# Altium schematic sheet Triggers.SchDoc: Triggers
size 420 x 297 mm; SheetNumber: 7; SheetTotal: 8
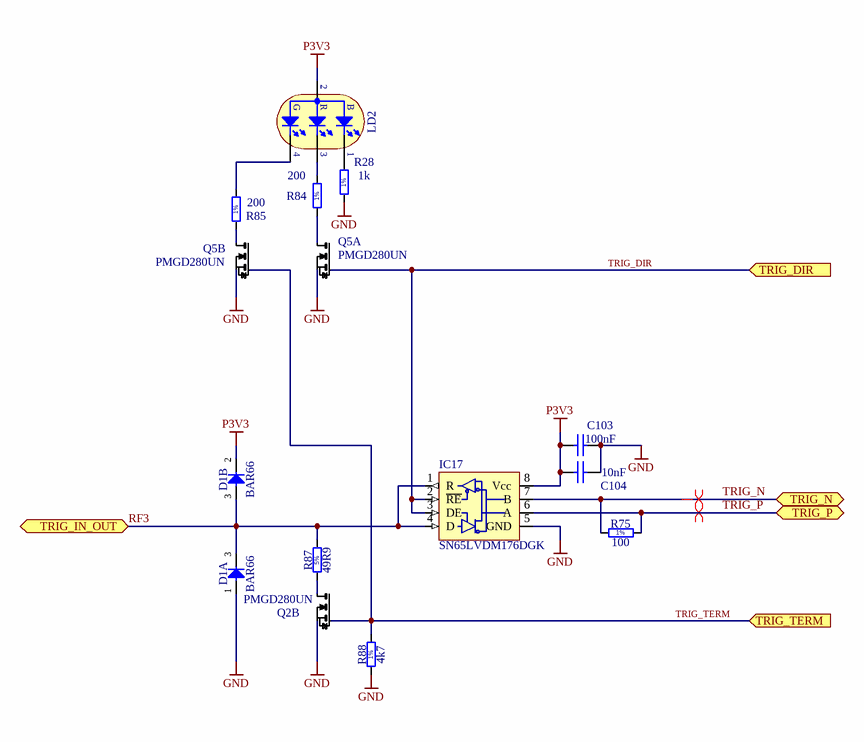
[diagram p0: Triggers.SchDoc]

## Parts
C103  100nF  [CAPC0603X33N]
C104  10nF  [CAPC0603X33N]
D1  BAR66  [SOT95P240X110-3N]  (parts A,B of 2)
IC17  SN65LVDM176DGK  [MSOP8 TI/AD]
LD2  Blue/Red/Green  [LED_AVAGO_HSMF-C113]  (value not drawn)
Q2  PMGD280UN  [SOT-363]  (part B of 2)
Q5  PMGD280UN  [SOT-363]  (parts A,B of 2)
R28  1k  [RESC1005X40N]
R75  100  [RESC1005X40N]
R84  200  [RESC1005X40N]
R85  200  [RESC1005X40N]
R87  49R9  [RESC3225X70N]
R88  4k7  [RESC1005X40N]

## Ports
TRIG_DIR (in), TRIG_IN_OUT (bidir), TRIG_N (bidir), TRIG_P (bidir), TRIG_TERM (in)

## Nets
GND: C103.2 C104.2 D1.1(A) IC17.5(GND) Q2.4(S1) Q5.1(S1) Q5.4(S1) R28.1 R88.1
P3V3: C103.1 C104.1 D1.2(C) IC17.8(Vcc) LD2.2(AC)
RF3: D1.3(COMAC) IC17.1(R) IC17.4(D) R87.2 ; port TRIG_IN_OUT
TRIG_DIR: IC17.2(~{RE}) IC17.3(DE) Q5.2(G1) ; port TRIG_DIR
TRIG_N: IC17.7(B) R75.1 ; port TRIG_N
TRIG_P: IC17.6(A) R75.2 ; port TRIG_P
TRIG_TERM: Q2.5(G1) Q5.5(G1) R88.2 ; port TRIG_TERM
NetLD2_1: LD2.1(CB) R28.2
NetLD2_3: LD2.3(CR) R84.2
NetLD2_4: LD2.4(CG) R85.2
NetQ2_6: Q2.6(D1) R87.1
NetQ5_3: Q5.3(D1) R84.1
NetQ5_6: Q5.6(D1) R85.1

## Layout directives
differential pair: TRIG_N, TRIG_P

## Notes on the sheet
- Project/Equipment
- Document
- FMC_130MSPS_4CH
- Designer
- Drawn by
- Check.by
- Copyright Creotech Instruments SA 2014.
  This documentation describes Open Hardware and is licensed under the CERN OHL v.1.1. You may redistribute and modify this documentation under the terms of the CERN OHL v.1.1. (http://ohwr.org/CERNOHL). This documentation is distributed WITHOUT ANY EXPRESS OR IMPLIED WARRANTY, INCLUDING OF MERCHANTABILITY, SATISFACTORY QUALITY AND FITNESS FOR A PARTICULAR PURPOSE. Please see the CERN OHL v.1.1 for applicable conditions.
- Creotech Instruments S.A.
- File
- Last Mod.
- Print Date
- Sheet
- Size
- A3
- of
- Rev
- (in symbol LED_AVAGO_HSMF-C113) G; R; B
- (in symbol R0402_1K_1%_0.0625W_100PPM) 1%
- (in symbol R0402_4K7_1%_0.0625W_100PPM) 1%
- (in symbol R0402_100R_1%_0.0625W_100PPM) 1%
- (in symbol R0402_200R_1%_0.0625W_100PPM) 1%
- (in symbol R1210_270R_5%_0.5W_200PPM) 5%

## Library data of the parts
C103 = CC0201_100NF_6.3V_10%_X5R: Non-polarised capacitor; Part Description: SMD Multilayer Chip Ceramic Capacitor; Manufacturer: GENERIC; Manufacturer1 Part Number: 02016D104KAT2A; Voltage: 6.3V; TC: X5R; Tolerance: ±10%; Table: Capacitors SMD; Part Number: CC0201_100NF_6.3V_10%_X5R; Component Kind: Standard; Component Type: Standard; Pin Count: 2; Value: 100nF; Status: Not Recommended; Manufacturer Part Number: CC0201_100NF_6.3V_10%_X5R; Case: 0201; Mounted: Yes; Socket: No; SMD: Yes; Manufacturer1 Example: AVX; Manufacturer1 ComponentHeight: 0.33mm; HelpURL: \\cern.ch\dfs\Applications\Altium\Datasheets\CC0201_X5R_AVX.pdf; Author: CERN DEM JLC; CreateDate: 2007-12-03; LatestRevisionDate: 2007-12-03
C104 = CC0201_10NF_10V_10%_X5R: Non-polarised capacitor; Part Description: SMD Multilayer Chip Ceramic Capacitor; Manufacturer: GENERIC; Manufacturer1 Part Number: 0201ZD103KAT2A; Voltage: 10V; TC: X5R; Tolerance: ±10%; Table: Capacitors SMD; Part Number: CC0201_10NF_10V_10%_X5R; Component Kind: Standard; Component Type: Standard; Pin Count: 2; Value: 10nF; Status: Not Recommended; Manufacturer Part Number: CC0201_10NF_10V_10%_X5R; Case: 0201; Mounted: Yes; Socket: No; SMD: Yes; Manufacturer1 Example: AVX; Manufacturer1 ComponentHeight: 0.33mm; HelpURL: \\cern.ch\dfs\Applications\Altium\Datasheets\CC0201_X5R_AVX.pdf; Author: CERN DEM JLC; CreateDate: 2007-12-03; LatestRevisionDate: 2007-12-03
D1 = BAR66: Serial Diode; Part Description: Silicon PIN Diode Array (Series Connected); Manufacturer: INFINEON; Voltage: 150V; Power: 250mA; Table: Diodes; Part Number: BAR66; Component Kind: Standard; Component Type: Standard; Device: BAR66; PackageDescription: SOT23 3-Leads, Pitch 0.95mm - Body 1.3x2.9mm, IPC Medium Density; Manufacturer Part Number: BAR66; Pin Count: 3; Case: SOT23; Mounted: Yes; Socket: No; SMD: Yes; ComponentHeight: 1.1mm; HelpURL: \\cern.ch\dfs\Applications\Altium\Datasheets\BAR66.pdf; Author: CERN DEM JLC; CreateDate: 18/1/2010; LatestRevisionDate: 5/10/2010
IC17 = SN65LVDM176: High Speed Differential Transceiver LVDS/LVTTL; ComponentLink1Description: Datasheet; ComponentLink1URL: C:\TSR\Laurin\Projects\FMC\CERN DAC\Parts\Digital\SN65LVDM176.pdf
LD2 = LED_AVAGO_HSMF-C113: Tricolor LEDs 1 Cathode Blue, 2 Common Anode, 3 Cathode Red, 4 Cathode Green; Part Description: Right Angle Tricolor (Blue, Red, Green) Surface Mount ChipLED; Manufacturer: AVAGO TECHNOLOGIES; Table: LEDs & Displays; Part Number: LED_AVAGO_HSMF-C113; Component Kind: Standard; Component Type: Standard; Color: Blue/Red/Green; PackageDescription: Right Angle Tricolor Surface Mount ChipLED, Body 2.5x1mm; Manufacturer Part Number: HSMF-C113; Pin Count: 4; Mounted: Yes; Socket: No; SMD: Yes; ComponentHeight: 1mm; HelpURL: \\cern.ch\dfs\Applications\Altium\Datasheets\LED_AVAGO_HSMF-C113.pdf; Author: CERN DEM JLC; CreateDate: 2010-09-29; LatestRevisionDate: 2010-09-29
Q2 Q5 = Q_PMGD280UN: Dual NMOS 20V,08.A, 340mR, Vt=0.7V
R28 = R0402_1K_1%_0.0625W_100PPM: Resistor - 1%; Part Description: General Purpose Thick Film Chip Resistor; Manufacturer: GENERIC; Manufacturer1 Part Number: 232270671002; TC: ±100ppm/°C; Table: Resistors SMD; Part Number: R0402_1K_1%_0.0625W_100PPM; Component Kind: Standard; Component Type: Standard; Pin Count: 2; Value: 1k; Status: Not recommended; Power: 0.0625W; Tolerance: ±1%; Manufacturer Part Number: R0402_1K_1%_0.0625W_100PPM; Case: 0402; Mounted: Yes; Socket: No; SMD: Yes; Manufacturer1 Example: PHYCOMP; Manufacturer1 ComponentHeight: 0.4mm; HelpURL: \\cern.ch\dfs\Applications\Altium\Datasheets\R0402_Phycomp_RC0402.pdf; Author: CERN DEM JLC; CreateDate: 2007-12-03; LatestRevisionDate: 2008-03-13
R75 = R0402_100R_1%_0.0625W_100PPM: Resistor - 1%; Part Description: General Purpose Thick Film Chip Resistor; Manufacturer: GENERIC; Manufacturer1 Part Number: 232270671001; TC: ±100ppm/°C; Table: Resistors SMD; Part Number: R0402_100R_1%_0.0625W_100PPM; Component Kind: Standard; Component Type: Standard; Pin Count: 2; Value: 100; Status: Not recommended; Power: 0.0625W; Tolerance: ±1%; Manufacturer Part Number: R0402_100R_1%_0.0625W_100PPM; Case: 0402; Mounted: Yes; Socket: No; SMD: Yes; Manufacturer1 Example: PHYCOMP; Manufacturer1 ComponentHeight: 0.4mm; HelpURL: \\cern.ch\dfs\Applications\Altium\Datasheets\R0402_Phycomp_RC0402.pdf; Author: CERN DEM JLC; CreateDate: 2007-12-03; LatestRevisionDate: 2008-03-13
R84 R85 = R0402_200R_1%_0.0625W_100PPM: Resistor - 1%; Part Description: General Purpose Thick Film Chip Resistor; Manufacturer: GENERIC; Manufacturer1 Part Number: 232270672001; TC: ±100ppm/°C; Table: Resistors SMD; Part Number: R0402_200R_1%_0.0625W_100PPM; Component Kind: Standard; Component Type: Standard; Pin Count: 2; Value: 200; Status: Not recommended; Power: 0.0625W; Tolerance: ±1%; Manufacturer Part Number: R0402_200R_1%_0.0625W_100PPM; Case: 0402; Mounted: Yes; Socket: No; SMD: Yes; Manufacturer1 Example: PHYCOMP; Manufacturer1 ComponentHeight: 0.4mm; HelpURL: \\cern.ch\dfs\Applications\Altium\Datasheets\R0402_Phycomp_RC0402.pdf; Author: CERN DEM JLC; CreateDate: 2007-12-03; LatestRevisionDate: 2008-03-13
R87 = R1210_270R_5%_0.5W_200PPM: Resistor - 5%; Part Number: R1210_49R9_1%_0.33W_100PPM; Part Description: General Purpose Thick Film Chip Resistor; Manufacturer: VISHAY; Manufacturer Part Number: CRCW121049R9FK; Power: 0.33W; TC: ±100ppm/°C; Table: Resistors SMD; Component Kind: Standard; Component Type: Standard; Pin Count: 2; Value: 49R9; Status: None; Tolerance: ±5%; Case: 1210; Mounted: Yes; Socket: No; SMD: Yes; ComponentHeight: 0.7mm; HelpURL: \\cern.ch\dfs\Applications\Altium\Datasheets\R1210_PANASONIC_ERJ.pdf; Author: CERN DEM JLC; CreateDate: 2011-10-26; LatestRevisionDate: 2011-10-26
R88 = R0402_4K7_1%_0.0625W_100PPM: Resistor - 1%; Part Description: General Purpose Thick Film Chip Resistor; Manufacturer: GENERIC; Manufacturer1 Part Number: 232270674702; TC: ±100ppm/°C; Table: Resistors SMD; Part Number: R0402_4K7_1%_0.0625W_100PPM; Component Kind: Standard; Component Type: Standard; Pin Count: 2; Value: 4k7; Status: Not recommended; Power: 0.0625W; Tolerance: ±1%; Manufacturer Part Number: R0402_4K7_1%_0.0625W_100PPM; Case: 0402; Mounted: Yes; Socket: No; SMD: Yes; Manufacturer1 Example: PHYCOMP; Manufacturer1 ComponentHeight: 0.4mm; HelpURL: \\cern.ch\dfs\Applications\Altium\Datasheets\R0402_Phycomp_RC0402.pdf; Author: CERN DEM JLC; CreateDate: 2007-12-03; LatestRevisionDate: 2008-03-13